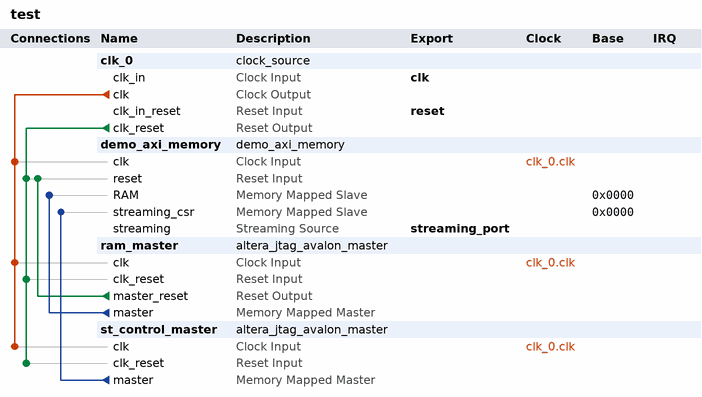
[diagram p0: system contents]
# Platform Designer (Qsys) system test, Cyclone IV GX Unknown
# Parameters at their usual value, and those the tool derives, are not listed.
package require -exact qsys 13.0
create_system test
set_project_property DEVICE_FAMILY {Cyclone IV GX}
set_project_property DEVICE Unknown

add_instance clk_0 clock_source 13.0
set_instance_parameter_value clk_0 clockFrequency 50000000

add_instance demo_axi_memory demo_axi_memory 1.0
set_instance_parameter_value demo_axi_memory AXI_ID_W 4
set_instance_parameter_value demo_axi_memory AXI_ADDRESS_W 12
set_instance_parameter_value demo_axi_memory AXI_DATA_W 32
set_instance_parameter_value demo_axi_memory ENABLE_STREAM_OUTPUT true
set_instance_parameter_value demo_axi_memory AV_ADDRESS_W 2
set_instance_parameter_value demo_axi_memory AV_DATA_W 16

add_instance ram_master altera_jtag_avalon_master 13.0

add_instance st_control_master altera_jtag_avalon_master 13.0

# connections
add_connection clk_0.clk demo_axi_memory.clk clock
add_connection clk_0.clk ram_master.clk clock
add_connection clk_0.clk st_control_master.clk clock
add_connection clk_0.clk_reset demo_axi_memory.reset reset
add_connection clk_0.clk_reset ram_master.clk_reset reset
add_connection clk_0.clk_reset st_control_master.clk_reset reset
add_connection ram_master.master_reset demo_axi_memory.reset reset
add_connection ram_master.master demo_axi_memory.RAM avalon
set_connection_parameter_value ram_master.master/demo_axi_memory.RAM baseAddress 0x0000
add_connection st_control_master.master demo_axi_memory.streaming_csr avalon
set_connection_parameter_value st_control_master.master/demo_axi_memory.streaming_csr baseAddress 0x0000

# exported interfaces
add_interface clk clock sink
set_interface_property clk EXPORT_OF clk_0.clk_in
add_interface reset reset sink
set_interface_property reset EXPORT_OF clk_0.clk_in_reset
add_interface streaming_port avalon_streaming source
set_interface_property streaming_port EXPORT_OF demo_axi_memory.streaming

set_interconnect_requirement {$system} qsys_mm.clockCrossingAdapter HANDSHAKE
set_interconnect_requirement {$system} qsys_mm.maxAdditionalLatency 1

save_system test.qsys
